# EasyEDA schematic EasyEDA Source.json

## Sheets
1 Processor: TITLE: Processor; REV: 1.1; Date: 2020-04-29; Sheet: 1/3; Drawn By: john.oconnell
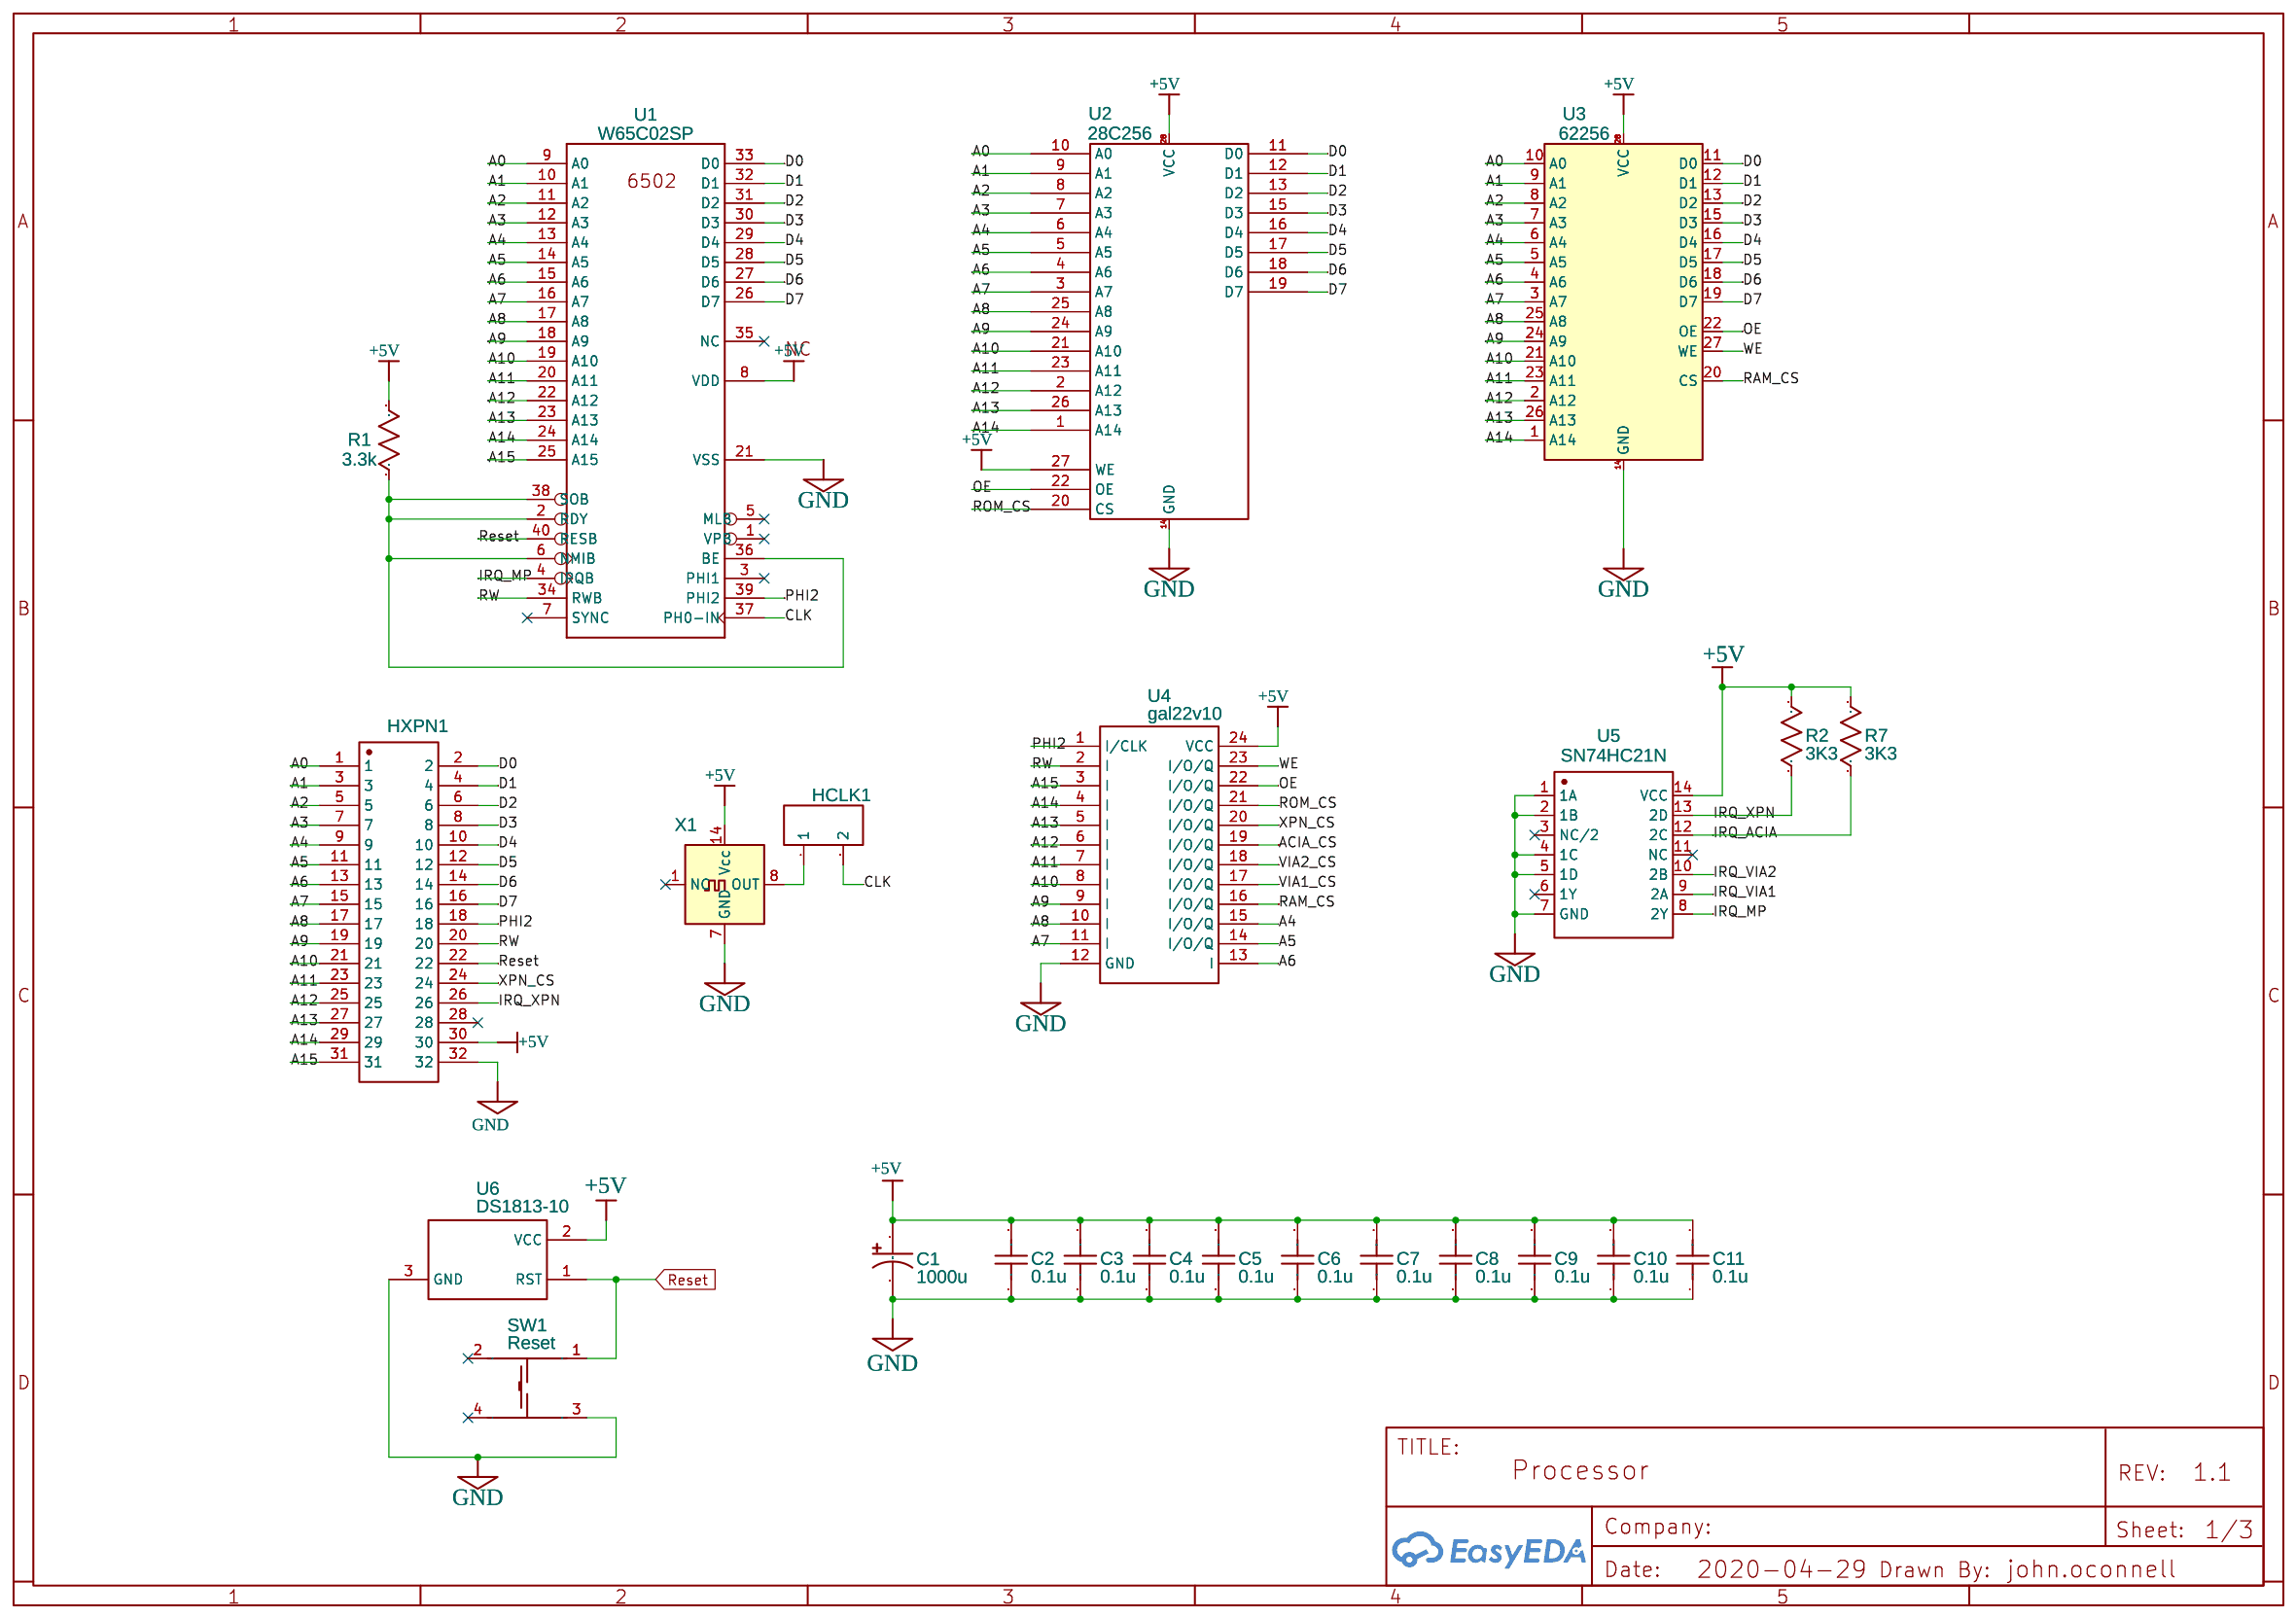
[diagram p0: Processor]
2 USB Serial: TITLE: USB Serial; Sheet: 2/3
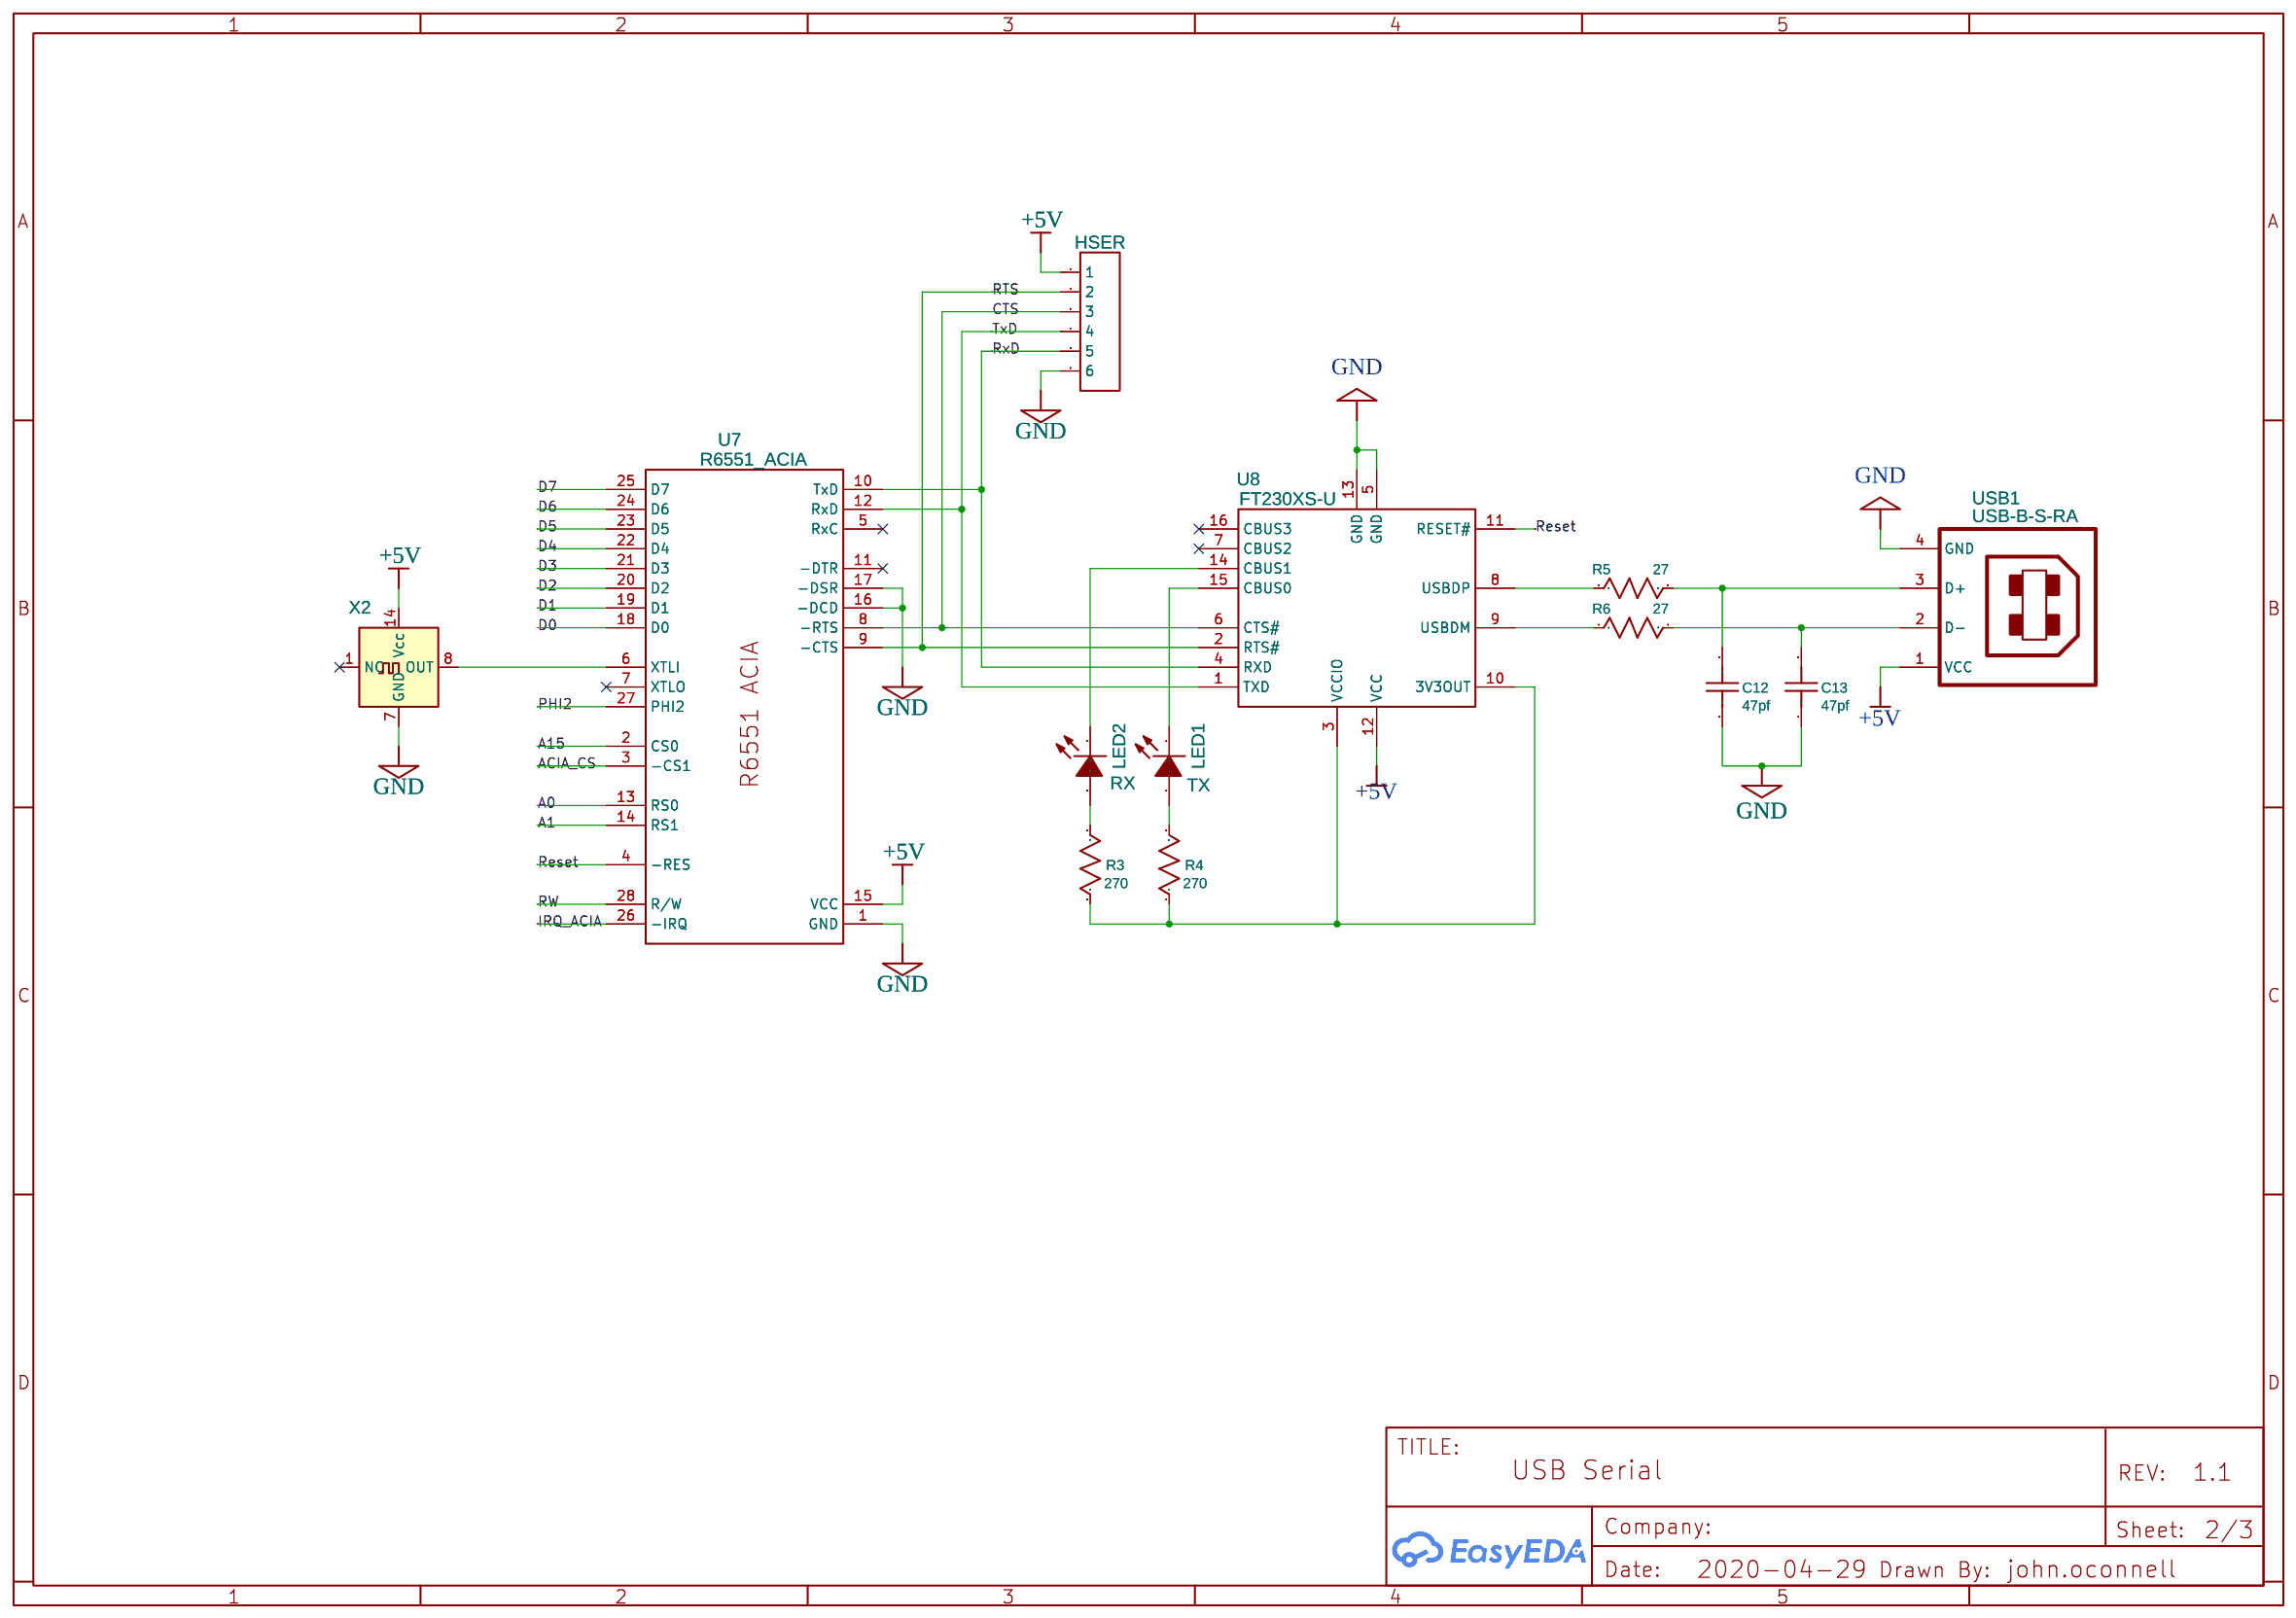
[diagram p1: USB Serial]
3 VIA IO: TITLE: VIA I/O; Sheet: 3/3
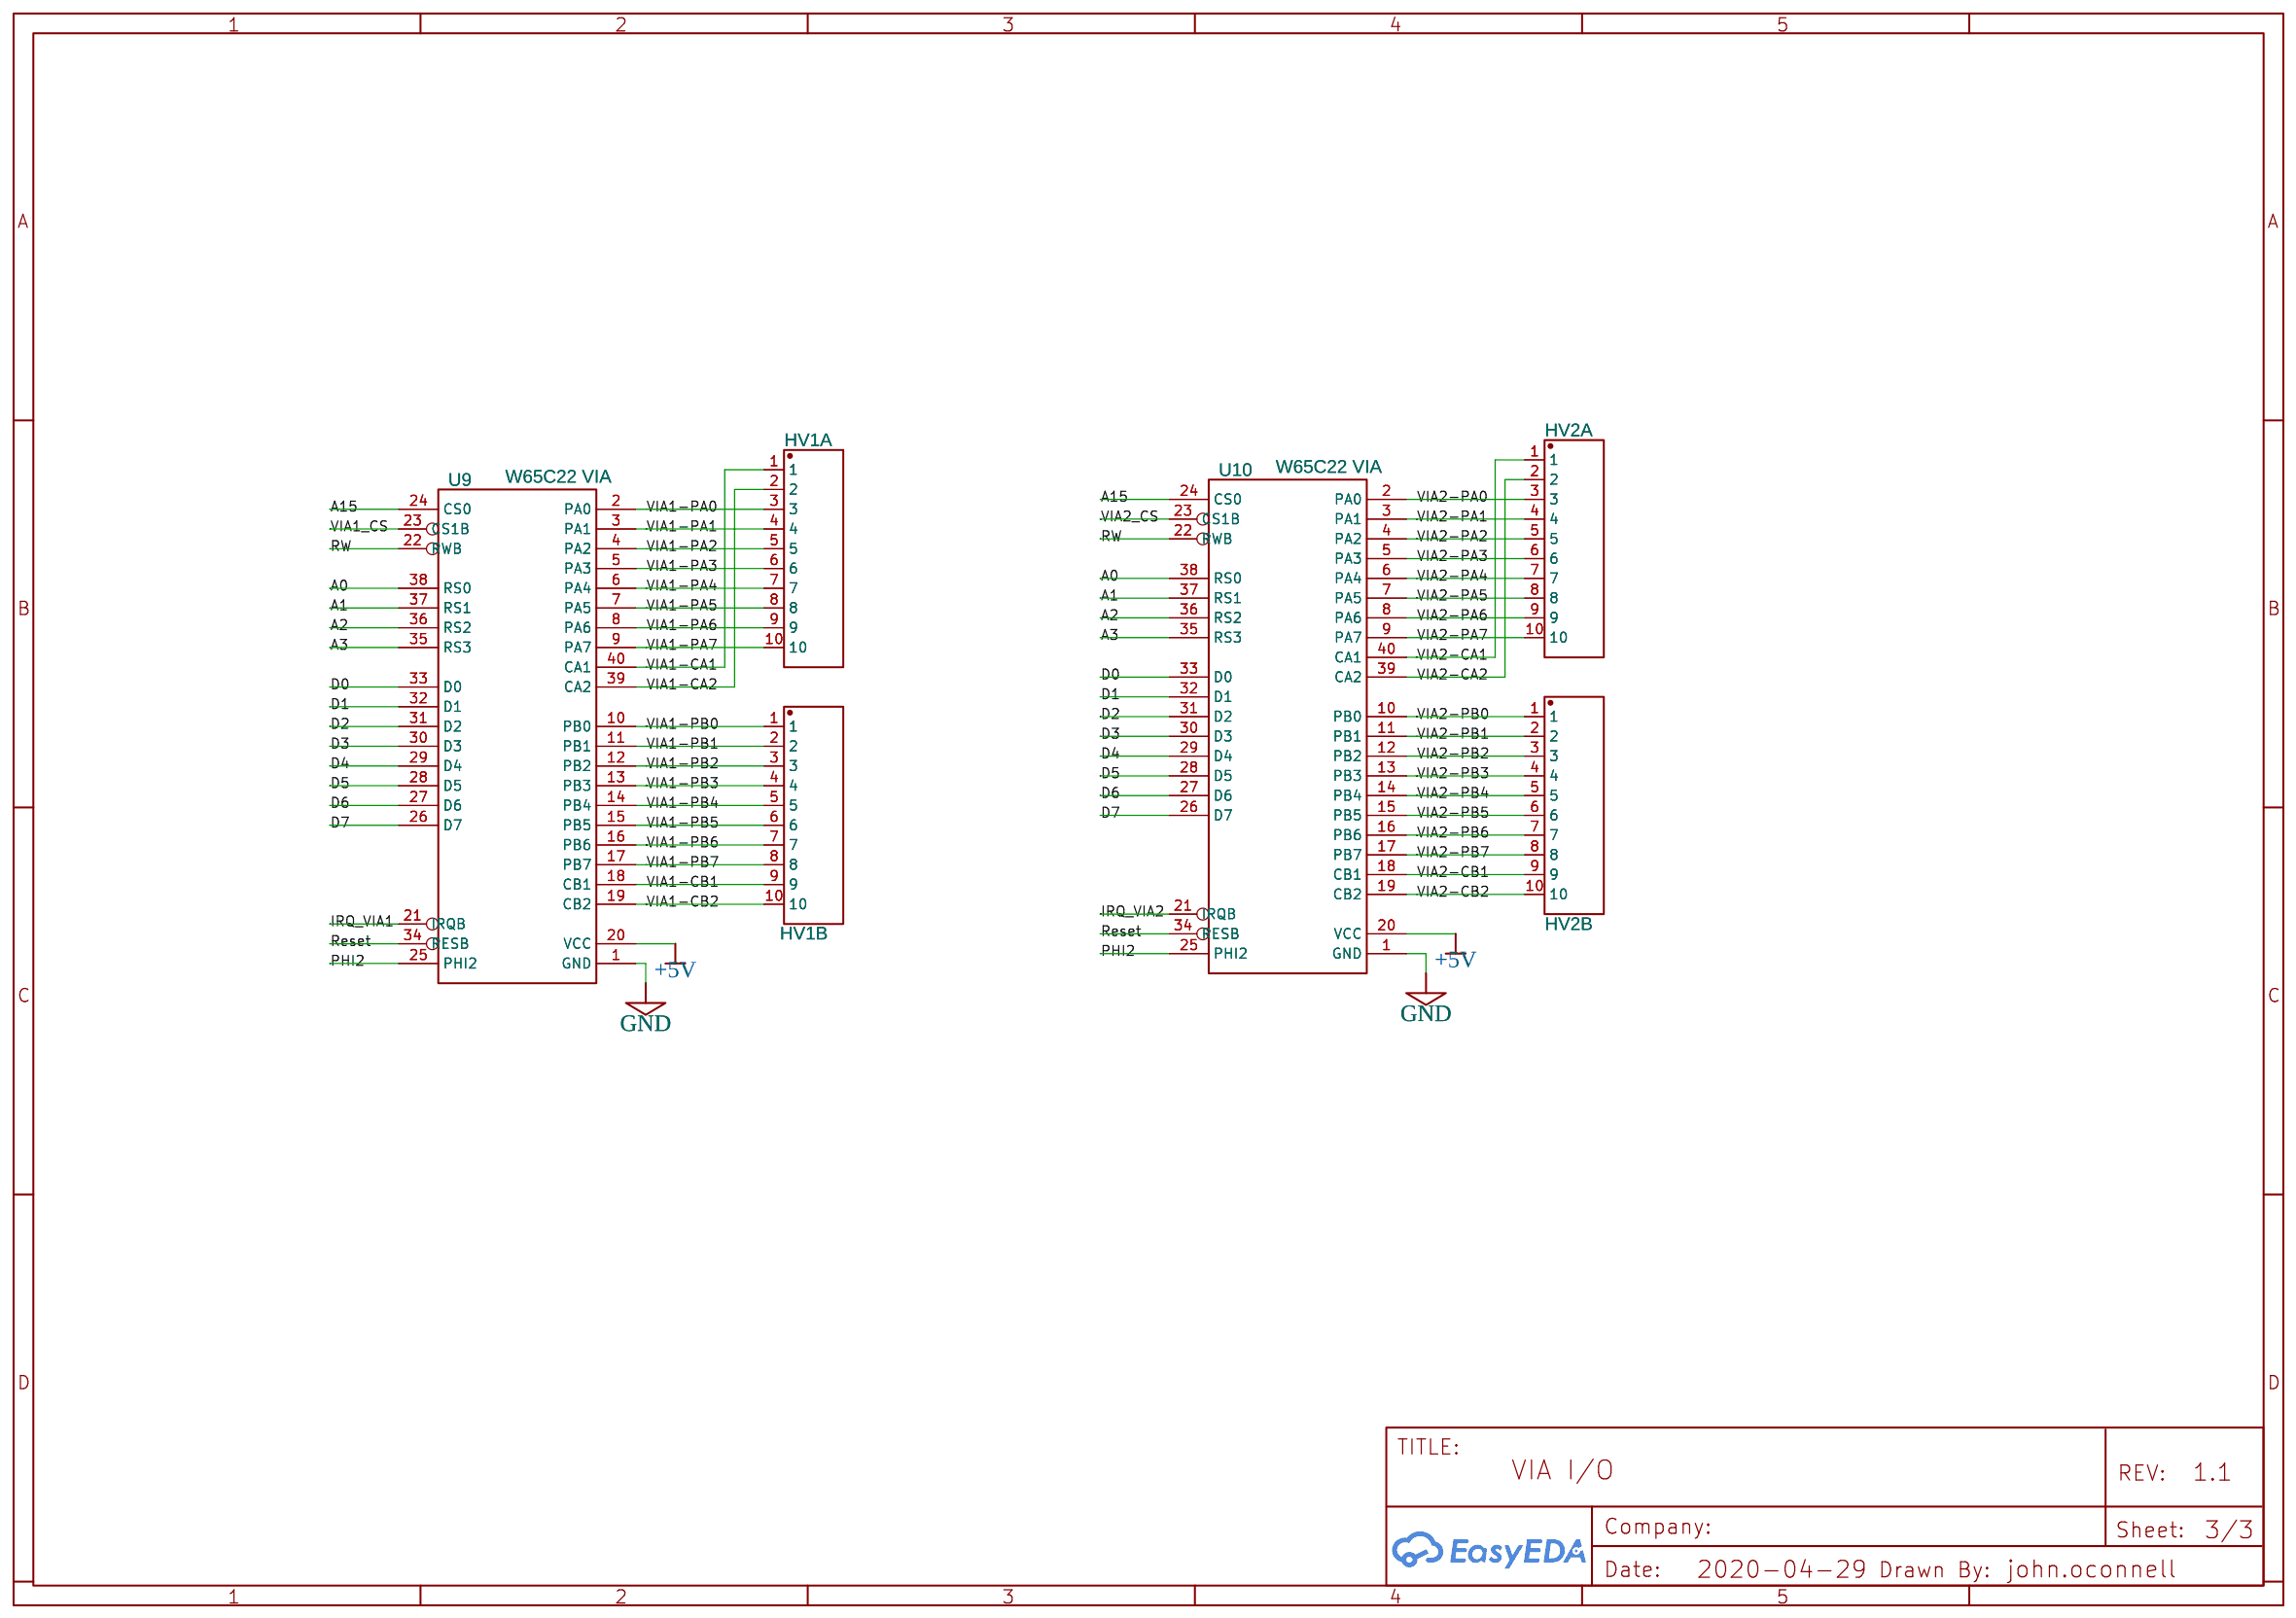
[diagram p2: VIA IO]

## Parts
sheet Processor
C1  1000u  [CAP-D10.0XF5.0]
C2  0.1u  [RAD-0.2]
C3  0.1u  [RAD-0.2]
C4  0.1u  [RAD-0.2]
C5  0.1u  [RAD-0.2]
C6  0.1u  [RAD-0.2]
C7  0.1u  [RAD-0.2]
C8  0.1u  [RAD-0.2]
C9  0.1u  [RAD-0.2]
C10  0.1u  [RAD-0.2]
C11  0.1u  [RAD-0.2]
HCLK1  Header-Male-2.54_1x2  [HDR-2X1/2.54]
HXPN1  210S-2*16P L=11.6MMGold-plated black  [HDR-TH_32P-P2.54-V-R2-C16-S2.54]
R1  3.3k  [AXIAL-0.4]
R2  3K3  [AXIAL-0.4]
R7  3K3  [AXIAL-0.4]
SW1  Reset  [KEY-6.0*6.0-2]
U1  W65C02SP  [DIP-40_W15.24MM_SOCKET_LONGPADS]
U2  28C256  [DIP-28_W15.24MM_SOCKET_LONGPADS]
U3  62256  [DIP-28_W15.24MM_SOCKET_LONGPADS]
U4  gal22v10  [DIP-24_W7.62MM_SOCKET_LONGPADS]
U5  SN74HC21N  [DIP-14_W7.62MM_SOCKET_LONGPADS]
U6  DS1813-10  [TO92-INLINE]
X1  1 MHZ  [OSCILLATOR_DIP-14]
sheet USB Serial
C12  47pf  [RAD-0.2]
C13  47pf  [RAD-0.2]
HSER  Header-Male-2.54_1x6  [HDR-TH_6P-P2.54-V]
LED1  TX  [LED-3MM/2.54]
LED2  RX  [LED-3MM/2.54]
R3  270  [AXIAL-0.4]
R4  270  [AXIAL-0.4]
R5  27  [AXIAL-0.4]
R6  27  [AXIAL-0.4]
U7  R6551_ACIA  [DIP-28_W15.24MM_SOCKET_LONGPADS]
U8  FT230XS-U  [SSOP-16_L5.0-W4.4-P0.65-LS6.4-BL]
USB1  USB-B-S-RA  [PKG-USB-B-S-RA]
X2  1.8432 MHZ  [OSCILLATOR_DIP-14]
sheet VIA IO
HV1A  210S-1*10P L=11.6MMGold-plated black  [210S-1X10P]
HV1B  210S-1*10P L=11.6MMGold-plated black  [210S-1X10P]
HV2A  210S-1*10P L=11.6MMGold-plated black  [210S-1X10P]
HV2B  210S-1*10P L=11.6MMGold-plated black  [210S-1X10P]
U9  W65C22 VIA  [DIP-40_W15.24MM_SOCKET_LONGPADS]
U10  W65C22 VIA  [DIP-40_W15.24MM_SOCKET_LONGPADS]

## Library data of the parts
C1 = Cap_Electrolytic(TH)_D3.0XF1.5_US
C2-C13 = Cap_RAD-0.1_US
HCLK1 = Header-Male-2.54_1x2: Supplier: LCSC; Manufacturer: TE Connectivity; Manufacturer Part: 826629-2; image: //image.lceda.cn/szlcsc/C86471.jpg; Supplier Part: C86471
HXPN1 = 210S-2*16P L=11.6MMGold-plated black: Supplier: LCSC; Manufacturer: Ckmtw; Contributor: LCSC; Supplier Part: C124382
R1-R7 = Res_AXIAL-0.4(1/4W)_US
SW1 = -: Supplier: LCSC; Manufacturer: HRO; Manufacturer Part: K2-1102SP-C4SC-04; Contributor: LCSC; Supplier Part: C127509
U2 U3 = -: Contributor: KiCAD; license: https://www.gnu.org/licenses/lgpl-2.1.html
U4 = gal22v10: Contributor: wawa1474
U5 = SN74HC21N
U6 = DS1813-10: 5V EconoReset with Pushbutton
X1 X2 = DGOF5S3: Contributor: KiCAD; license: https://www.gnu.org/licenses/lgpl-2.1.html
HSER = Header-Male-2.54_1x6: Supplier: LCSC; Manufacturer: BOOMELE; Supplier Part: C37208
LED1 LED2 = 204-10SURD/S530-A3: Supplier: LCSC; Manufacturer: EVERLIGHT; Supplier Part: C99772
U7 = R6551_ACIA: Manufacturer Part: 6551 ACIA; Contributor: MCCreeper8890
U8 = FT230XS-U: Supplier: LCSC; Manufacturer: FTDI; Contributor: LCSC; Supplier Part: C132162; LCSC Assembly: Yes; SMT Type: Extend
USB1 = USB-B-S-RA: Supplier Part: 2112373; Supplier: Element14; Manufacturer: MULTICOMP; link: http://www.farnell.com/datasheets/1788391.pdf?_ga=2.173802404.606936064.1521209884-238689616.1505921947&_gac=1.254003772.1521209884.EAIaIQobChMIuuzFs4Tx2QIVxinTCh00wgDCEAAYASAAEgJYKfD_BwE; Contributor: Prof. Ing. F. Scordino
HV1A HV1B HV2A HV2B = -: Supplier: LCSC; Manufacturer: Ckmtw; Contributor: LCSC; Supplier Part: C124372
U9 U10 = -: Manufacturer Part: 6522; Contributor: MCCreeper8890

## Nets
+5V: C1.1 C2.2 C3.2 C4.2 C5.2 C6.2 C7.2 C8.2 C9.2 C10.2 C11.2 HSER.1 HXPN1.30 R1.2 R2.2 R7.2 U1.8(VDD) U2.27(WE) U2.28(VCC) U3.28(VCC) U4.24(VCC) U5.14(VCC) U6.2(VCC) U7.15(VCC) U8.12(VCC) U9.20(VCC) U10.20(VCC) USB1.1(VCC) X1.14(Vcc) X2.14(Vcc)
GND: C1.2 C2.1 C3.1 C4.1 C5.1 C6.1 C7.1 C8.1 C9.1 C10.1 C11.1 C12.1 C13.1 HSER.6 HXPN1.32 SW1.3 U1.21(VSS) U2.14(GND) U3.14(GND) U4.12(GND) U5.1(1A) U5.2(1B) U5.4(1C) U5.5(1D) U5.7(GND) U6.3(GND) U7.1(GND) U7.16(-DCD) U7.17(-DSR) U8.5(GND) U8.13(GND) U9.1(GND) U10.1(GND) USB1.4(GND) X1.7(GND) X2.7(GND)
A0: HXPN1.1 U1.9(A0) U2.10(A0) U3.10(A0) U7.13(RS0) U9.38(RS0) U10.38(RS0)
A1: HXPN1.3 U1.10(A1) U2.9(A1) U3.9(A1) U7.14(RS1) U9.37(RS1) U10.37(RS1)
A2: HXPN1.5 U1.11(A2) U2.8(A2) U3.8(A2) U9.36(RS2) U10.36(RS2)
A3: HXPN1.7 U1.12(A3) U2.7(A3) U3.7(A3) U9.35(RS3) U10.35(RS3)
A4: HXPN1.9 U1.13(A4) U2.6(A4) U3.6(A4) U4.15(I/O/Q)
A5: HXPN1.11 U1.14(A5) U2.5(A5) U3.5(A5) U4.14(I/O/Q)
A6: HXPN1.13 U1.15(A6) U2.4(A6) U3.4(A6) U4.13(I)
A7: HXPN1.15 U1.16(A7) U2.3(A7) U3.3(A7) U4.11(I)
A8: HXPN1.17 U1.17(A8) U2.25(A8) U3.25(A8) U4.10(I)
A9: HXPN1.19 U1.18(A9) U2.24(A9) U3.24(A9) U4.9(I)
A10: HXPN1.21 U1.19(A10) U2.21(A10) U3.21(A10) U4.8(I)
A11: HXPN1.23 U1.20(A11) U2.23(A11) U3.23(A11) U4.7(I)
A12: HXPN1.25 U1.22(A12) U2.2(A12) U3.2(A12) U4.6(I)
A13: HXPN1.27 U1.23(A13) U2.26(A13) U3.26(A13) U4.5(I)
A14: HXPN1.29 U1.24(A14) U2.1(A14) U3.1(A14) U4.4(I)
A15: HXPN1.31 U1.25(A15) U4.3(I) U7.2(CS0) U9.24(CS0) U10.24(CS0)
ACIA_CS: U4.19(I/O/Q) U7.3(-CS1)
CLK: HCLK1.2 U1.37(PH0-IN)
CTS: HSER.3 U7.8(-RTS) U8.6(CTS#)
D0: HXPN1.2 U1.33(D0) U2.11(D0) U3.11(D0) U7.18(D0) U9.33(D0) U10.33(D0)
D1: HXPN1.4 U1.32(D1) U2.12(D1) U3.12(D1) U7.19(D1) U9.32(D1) U10.32(D1)
D2: HXPN1.6 U1.31(D2) U2.13(D2) U3.13(D2) U7.20(D2) U9.31(D2) U10.31(D2)
D3: HXPN1.8 U1.30(D3) U2.15(D3) U3.15(D3) U7.21(D3) U9.30(D3) U10.30(D3)
D4: HXPN1.10 U1.29(D4) U2.16(D4) U3.16(D4) U7.22(D4) U9.29(D4) U10.29(D4)
D5: HXPN1.12 U1.28(D5) U2.17(D5) U3.17(D5) U7.23(D5) U9.28(D5) U10.28(D5)
D6: HXPN1.14 U1.27(D6) U2.18(D6) U3.18(D6) U7.24(D6) U9.27(D6) U10.27(D6)
D7: HXPN1.16 U1.26(D7) U2.19(D7) U3.19(D7) U7.25(D7) U9.26(D7) U10.26(D7)
IRQ_ACIA: R7.1 U5.12(2C) U7.26(-IRQ)
IRQ_MP: U1.4(IRQB) U5.8(2Y)
IRQ_VIA1: U5.9(2A) U9.21(IRQB)
IRQ_VIA2: U5.10(2B) U10.21(IRQB)
IRQ_XPN: HXPN1.26 R2.1 U5.13(2D)
OE: U2.22(OE) U3.22(OE) U4.22(I/O/Q)
PHI2: HXPN1.18 U1.39(PHI2) U4.1(I/CLK) U7.27(PHI2) U9.25(PHI2) U10.25(PHI2)
RAM_CS: U3.20(CS) U4.16(I/O/Q)
Reset: HXPN1.22 SW1.1 U1.40(RESB) U6.1(RST) U7.4(-RES) U8.11(RESET#) U9.34(RESB) U10.34(RESB)
ROM_CS: U2.20(CS) U4.21(I/O/Q)
RTS: HSER.2 U7.9(-CTS) U8.2(RTS#)
RW: HXPN1.20 U1.34(RWB) U4.2(I) U7.28(R/W) U9.22(RWB) U10.22(RWB)
RxD: HSER.5 U7.10(TxD) U8.4(RXD)
TxD: HSER.4 U7.12(RxD) U8.1(TXD)
VIA1-CA1: HV1A.1 U9.40(CA1)
VIA1-CA2: HV1A.2 U9.39(CA2)
VIA1-CB1: HV1B.9 U9.18(CB1)
VIA1-CB2: HV1B.10 U9.19(CB2)
VIA1-PA0: HV1A.3 U9.2(PA0)
VIA1-PA1: HV1A.4 U9.3(PA1)
VIA1-PA2: HV1A.5 U9.4(PA2)
VIA1-PA3: HV1A.6 U9.5(PA3)
VIA1-PA4: HV1A.7 U9.6(PA4)
VIA1-PA5: HV1A.8 U9.7(PA5)
VIA1-PA6: HV1A.9 U9.8(PA6)
VIA1-PA7: HV1A.10 U9.9(PA7)
VIA1-PB0: HV1B.1 U9.10(PB0)
VIA1-PB1: HV1B.2 U9.11(PB1)
VIA1-PB2: HV1B.3 U9.12(PB2)
VIA1-PB3: HV1B.4 U9.13(PB3)
VIA1-PB4: HV1B.5 U9.14(PB4)
VIA1-PB5: HV1B.6 U9.15(PB5)
VIA1-PB6: HV1B.7 U9.16(PB6)
VIA1-PB7: HV1B.8 U9.17(PB7)
VIA1_CS: U4.17(I/O/Q) U9.23(CS1B)
VIA2-CA1: HV2A.1 U10.40(CA1)
VIA2-CA2: HV2A.2 U10.39(CA2)
VIA2-CB1: HV2B.9 U10.18(CB1)
VIA2-CB2: HV2B.10 U10.19(CB2)
VIA2-PA0: HV2A.3 U10.2(PA0)
VIA2-PA1: HV2A.4 U10.3(PA1)
VIA2-PA2: HV2A.5 U10.4(PA2)
VIA2-PA3: HV2A.6 U10.5(PA3)
VIA2-PA4: HV2A.7 U10.6(PA4)
VIA2-PA5: HV2A.8 U10.7(PA5)
VIA2-PA6: HV2A.9 U10.8(PA6)
VIA2-PA7: HV2A.10 U10.9(PA7)
VIA2-PB0: HV2B.1 U10.10(PB0)
VIA2-PB1: HV2B.2 U10.11(PB1)
VIA2-PB2: HV2B.3 U10.12(PB2)
VIA2-PB3: HV2B.4 U10.13(PB3)
VIA2-PB4: HV2B.5 U10.14(PB4)
VIA2-PB5: HV2B.6 U10.15(PB5)
VIA2-PB6: HV2B.7 U10.16(PB6)
VIA2-PB7: HV2B.8 U10.17(PB7)
VIA2_CS: U4.18(I/O/Q) U10.23(CS1B)
WE: U3.27(WE) U4.23(I/O/Q)
XPN_CS: HXPN1.24 U4.20(I/O/Q)
Net-(C12-2): C12.2 R5.2 USB1.3(D+)
Net-(C13-2): C13.2 R6.2 USB1.2(D-)
Net-(HCLK1-1): HCLK1.1 X1.8(OUT)
Net-(LED1-1): LED1.1(A) R4.2
Net-(LED1-2): LED1.2(K) U8.15(CBUS0)
Net-(LED2-1): LED2.1(A) R3.2
Net-(LED2-2): LED2.2(K) U8.14(CBUS1)
Net-(R1-1): R1.1 U1.2(RDY) U1.6(NMIB) U1.36(BE) U1.38(SOB)
Net-(R3-1): R3.1 R4.1 U8.3(VCCIO) U8.10(3V3OUT)
Net-(R5-1): R5.1 U8.8(USBDP)
Net-(R6-1): R6.1 U8.9(USBDM)
Net-(U7-6): U7.6(XTLI) X2.8(OUT)

Not connected (* = marked no-connect by the designer): HXPN1 28*; SW1 2* 4*; U1 1(VPB)* 3(PHI1)* 5(MLB)* 7(SYNC)* 35(NC)*; U5 3(NC/2)* 6(1Y)* 11(NC)*; U7 5(RxC)* 7(XTLO)* 11(-DTR)*; U8 7(CBUS2)* 16(CBUS3)*; X1 1(NC)*; X2 1(NC)*
